# Altium schematic sheet commucation.SchDoc
size A4; SheetNumber: 2; SheetTotal: 8
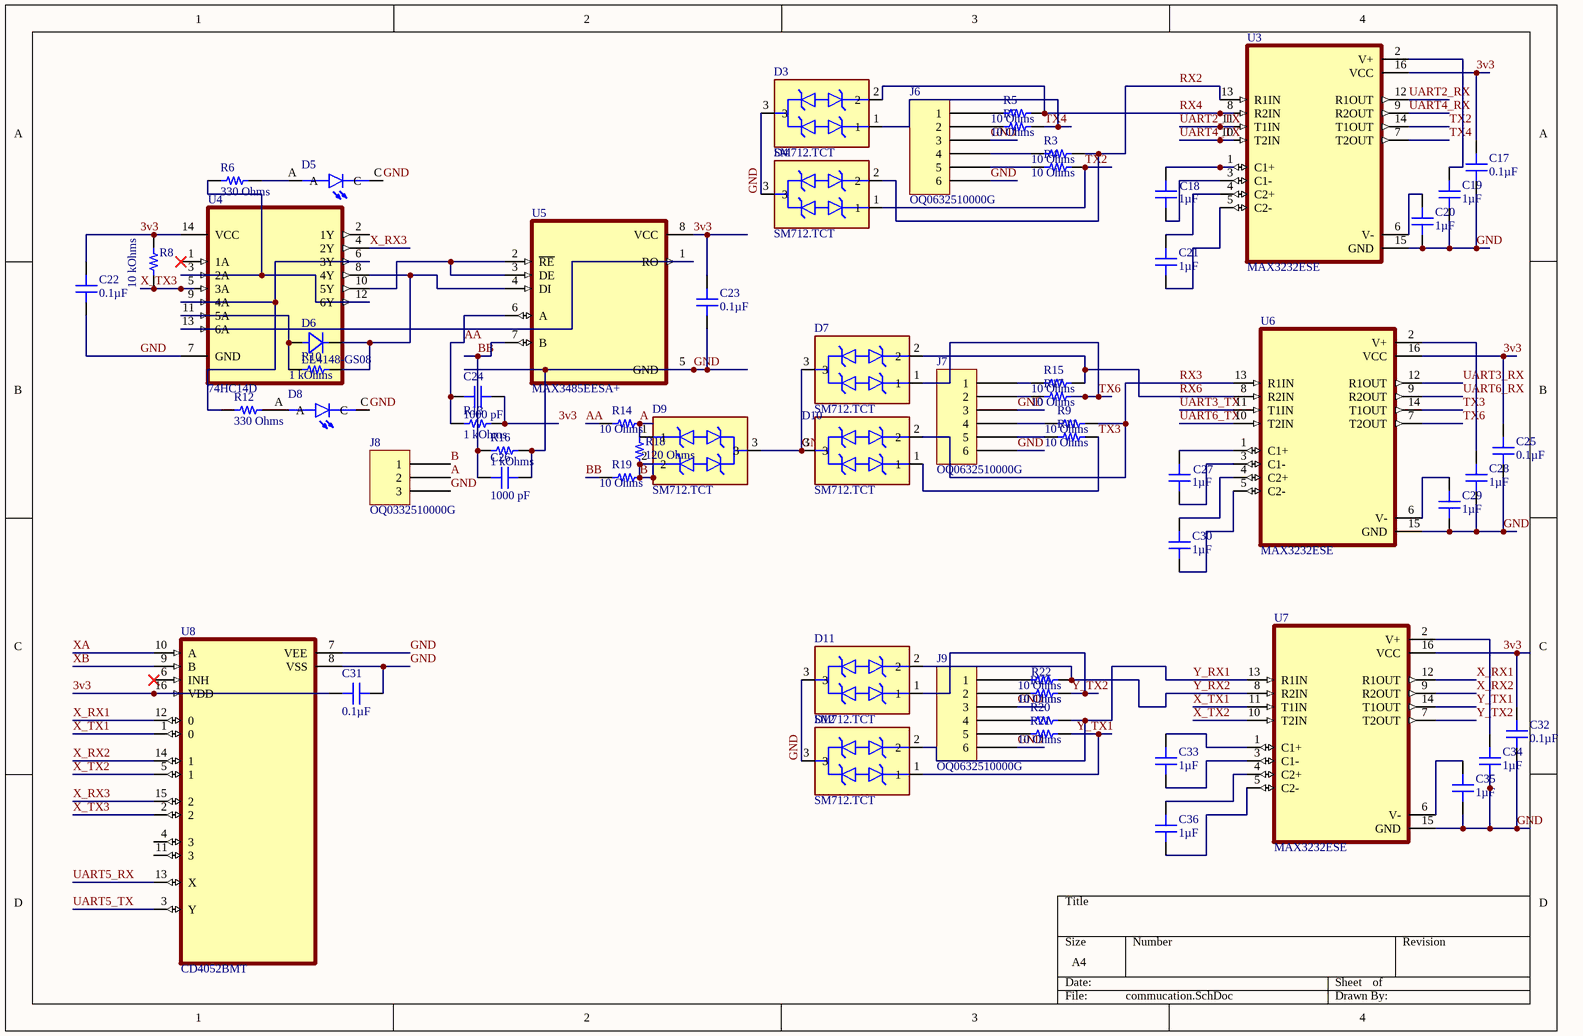
[diagram p0: commucation.SchDoc]

## Parts
C17  Capacitance: 0.1µF  [CAP 0805_2012]  (hidden comment: 1µF)
C18  1µF  [CAP 0805_2012]
C19  1µF  [CAP 0805_2012]
C20  1µF  [CAP 0805_2012]
C21  1µF  [CAP 0805_2012]
C22  Capacitance: 0.1µF  [CAP 0805_2012]  (hidden comment: 1µF)
C23  Capacitance: 0.1µF  [CAP 0805_2012]  (hidden comment: 1µF)
C24  1000 pF  [CAP 0805_2012]
C25  Capacitance: 0.1µF  [CAP 0805_2012]  (hidden comment: 1µF)
C26  1000 pF  [CAP 0805_2012]
C27  1µF  [CAP 0805_2012]
C28  1µF  [CAP 0805_2012]
C29  1µF  [CAP 0805_2012]
C30  1µF  [CAP 0805_2012]
C31  Capacitance: 0.1µF  [CAP 0805_2012]  (hidden comment: 1µF)
C32  Capacitance: 0.1µF  [CAP 0805_2012]  (hidden comment: 1µF)
C33  1µF  [CAP 0805_2012]
C34  1µF  [CAP 0805_2012]
C35  1µF  [CAP 0805_2012]
C36  1µF  [CAP 0805_2012]
D3  SM712.TCT  [SM712.TCT]
D4  SM712.TCT  [SM712.TCT]
D5  597-3305-607F  [LEDC2012X70N]  (value not drawn)
D6  LL4148-GS08  [MELF_SOD-80]
D7  SM712.TCT  [SM712.TCT]
D8  597-3305-607F  [LEDC2012X70N]  (value not drawn)
D9  SM712.TCT  [SM712.TCT]
D10  SM712.TCT  [SM712.TCT]
D11  SM712.TCT  [SM712.TCT]
D12  SM712.TCT  [SM712.TCT]
J6  OQ0632510000G  [FCI 06-381-6PIN]
J7  OQ0632510000G  [FCI 06-381-6PIN]
J8  OQ0332510000G  [FCI 06-381-3PIN]
J9  OQ0632510000G  [FCI 06-381-6PIN]
R3  10 Ohms  [RES 0805_2012]
R4  10 Ohms  [RES 0805_2012]
R5  10 Ohms  [RES 0805_2012]
R6  330 Ohms  [RES 0805_2012]
R7  10 Ohms  [RES 0805_2012]
R8  10 kOhms  [RES 0805_2012]
R9  10 Ohms  [RES 0805_2012]
R10  1 kOhms  [RES 0805_2012]
R11  10 Ohms  [RES 0805_2012]
R12  330 Ohms  [RES 0805_2012]
R13  1 kOhms  [RES 0805_2012]
R14  10 Ohms  [RES 0805_2012]
R15  10 Ohms  [RES 0805_2012]
R16  1 kOhms  [RES 0805_2012]
R17  10 Ohms  [RES 0805_2012]
R18  120 Ohms  [RES 0805_2012]
R19  10 Ohms  [RES 0805_2012]
R20  10 Ohms  [RES 0805_2012]
R21  10 Ohms  [RES 0805_2012]
R22  10 Ohms  [RES 0805_2012]
R23  10 Ohms  [RES 0805_2012]
U3  MAX3232ESE  [SOIC127P600X175-16N]
U4  74HC14D  [SOIC127P600X175-14N]
U5  MAX3485EESA+  [SOIC127P600X175-8N]
U6  MAX3232ESE  [SOIC127P600X175-16N]
U7  MAX3232ESE  [SOIC127P600X175-16N]
U8  CD4052BMT  [SOIC127P600X175-16N]

## Nets
3v3: C17.2 C22.2 C23.2 C24.2 C25.2 C31.1 C32.2 R8.2 R13.2 U3.16(VCC) U4.14(VCC) U5.8(VCC) U6.16(VCC) U7.16(VCC) U8.16(VDD)
A: D9.1 J8.2 R14.2 R18.2
AA: C24.1 R13.1 R14.1 U5.6(A)
B: D9.2 J8.1 R18.1 R19.2
BB: C26.1 R16.1 R19.1 U5.7(B)
GND: C17.1 C19.1 C20.1 C22.1 C23.1 C25.1 C26.2 C28.1 C29.1 C31.2 C32.1 C34.1 C35.1 D3.3 D4.3 D5.C D7.3 D8.C D9.3 D10.3 D11.3 D12.3 J6.3 J6.6 J7.3 J7.6 J8.3 J9.3 J9.6 R16.2 U3.15(GND) U4.7(GND) U5.5(GND) U6.15(GND) U7.15(GND) U8.7(VEE) U8.8(VSS)
RX2: D4.2 R3.2 U3.13(R1IN)
RX3: D10.2 R9.2 U6.13(R1IN)
RX4: D3.2 R5.2 U3.8(R2IN)
RX6: D7.2 R15.2 U6.8(R2IN)
TX2: D4.1 R4.2 U3.14(T1OUT)
TX3: D10.1 R11.2 U6.14(T1OUT)
TX4: D3.1 R7.2 U3.7(T2OUT)
TX6: D7.1 R17.2 U6.7(T2OUT)
UART2_RX: U3.12(R1OUT)
UART2_TX: U3.11(T1IN)
UART3_RX: U6.12(R1OUT)
UART3_TX: U6.11(T1IN)
UART4_RX: U3.9(R2OUT)
UART4_TX: U3.10(T2IN)
UART5_RX: U8.13(X)
UART5_TX: U8.3(Y)
UART6_RX: U6.9(R2OUT)
UART6_TX: U6.10(T2IN)
X_RX1: U7.12(R1OUT) U8.12(0)
X_RX2: U7.9(R2OUT) U8.14(1)
X_RX3: U4.4(2Y) U8.15(2)
X_TX1: U7.11(T1IN) U8.1(0)
X_TX2: U7.10(T2IN) U8.5(1)
X_TX3: R8.1 U4.5(3A) U8.2
XA: U8.10(A)
XB: U8.9(B)
Y_RX1: D12.2 R20.2 U7.13(R1IN)
Y_RX2: D11.2 R22.2 U7.8(R2IN)
Y_TX1: D12.1 R21.2 U7.14(T1OUT)
Y_TX2: D11.1 R23.2 U7.7(T2OUT)
NetC18_1: C18.1 U3.3(C1-)
NetC18_2: C18.2 U3.1(C1+)
NetC19_2: C19.2 U3.2(V+)
NetC20_2: C20.2 U3.6(V-)
NetC21_1: C21.1 U3.5(C2-)
NetC21_2: C21.2 U3.4(C2+)
NetC27_1: C27.1 U6.3(C1-)
NetC27_2: C27.2 U6.1(C1+)
NetC28_2: C28.2 U6.2(V+)
NetC29_2: C29.2 U6.6(V-)
NetC30_1: C30.1 U6.5(C2-)
NetC30_2: C30.2 U6.4(C2+)
NetC33_1: C33.1 U7.3(C1-)
NetC33_2: C33.2 U7.1(C1+)
NetC34_2: C34.2 U7.2(V+)
NetC35_2: C35.2 U7.6(V-)
NetC36_1: C36.1 U7.5(C2-)
NetC36_2: C36.2 U7.4(C2+)
NetD5_A: D5.A R6.2
NetD6_1: D6.1 R10.1 U4.11(5A)
NetD6_2: D6.2 R10.2 U4.8(4Y) U5.4(DI)
NetD8_A: D8.A R12.2
NetJ6_1: J6.1 R5.1
NetJ6_2: J6.2 R7.1
NetJ6_4: J6.4 R3.1
NetJ6_5: J6.5 R4.1
NetJ7_1: J7.1 R15.1
NetJ7_2: J7.2 R17.1
NetJ7_4: J7.4 R9.1
NetJ7_5: J7.5 R11.1
NetJ9_1: J9.1 R22.1
NetJ9_2: J9.2 R23.1
NetJ9_4: J9.4 R20.1
NetJ9_5: J9.5 R21.1
NetR6_1: R6.1 U4.3(2A) U4.12(6Y)
NetR12_1: R12.1 U4.6(3Y) U4.9(4A)
NetU4_10: U4.10(5Y) U5.2(~{RE}) U5.3(DE)
NetU4_13: U4.13(6A) U5.1(RO)

Not connected (* = marked no-connect by the designer): U4 1(1A)* 2(1Y); U8 4(3) 6(INH)* 11(3)

## Library data of the parts
C17-C23 C25 C27-C36 = 0805ZC105KAT4A: CAP CER 1UF 10V X7R 0805; manufacturer: AVX Corporation; Tolerance: ±10%; Part Number: 0805ZC105KAT4A; Applications: General Purpose; componentlink1description: Datasheet; componentlink1url: http://datasheets.avx.com/X7RDielectric.pdf; componentlink2description: DigiKey Link; componentlink2url: http://digikey.com/product-detail/en/avx-corporation/0805ZC105KAT4A/478-7604-1-ND/7536237; Device Package: 0805 (2012 Metric); lastupdated: 02-09-2020 1.04.40 AM; Lifecycle Status: Active; Minimum Order: 1; Mounting Type: Surface Mount, MLCC; Operating Temperature: -55°C ~ 125°C; Package / Case: 0805 (2012 Metric); packaging: TapeAndReel; partid: 3500; Part Status: Active; price: 0.17; series: -; Size / Dimension: 0.079" L x 0.049" W (2.00mm x 1.25mm); Supplier 1: DigiKey; Supplier Part Number 1: 478-7604-1-ND; Temperature Coefficient: X7R; Thickness (Max): 0.037" (0.94mm); value: 1µF; Voltage - Rated: 10V
  C18-C21 C27-C30 C33-C36: Capacitance: 1µF
C24 C26 = C0805C102F3HACAUTO: CAP CER 0805 1NF 25V ULTRA STABL; manufacturer: KEMET; Temperature Coefficient: X8R; Tolerance: ±1%; Part Number: C0805C102F3HACAUTO; Capacitance: 1000 pF; Applications: Automotive; componentlink1description: Datasheet; componentlink1url: https://api.kemet.com/component-edge/download/datasheet/C0805C102F3HACAUTO.pdf; componentlink2description: DigiKey Link; componentlink2url: https://www.digikey.com/en/products/detail/kemet/C0805C102F3HACAUTO/7958218; Device Package: 0805 (2012 Metric); Features: Low ESL, High Temperature; lastupdated: 09-02-2024 8.15.10 PM; Lifecycle Status: Active; Minimum Order: 1; Mounting Type: Surface Mount, MLCC; Operating Temperature: -55°C ~ 150°C; Package / Case: 0805 (2012 Metric); packaging: TapeAndReel; partid: 32894; Part Status: Active; price: 0.04; Ratings: AEC-Q200; series: SMD Auto X8R HT150C; Size / Dimension: 0.079" L x 0.049" W (2.00mm x 1.25mm); Supplier 1: DigiKey; Supplier Part Number 1: 399-C0805C102F3HACAUTOCT-ND; Thickness (Max): 0.035" (0.88mm); value: 1000 pF; Voltage - Rated: 25V
D3 D4 D7 D9-D12 = SM712.TCT: SM Series 12 V 400 W Asymmetrical TVS Diode for Extended Common-Mode - SOT-23; MF: Semtech Corporation; SnapEDA_Link: https://www.snapeda.com/parts/SM712.TCT/Semtech/view-part/?ref=snap; Package: SOT-23 Semtech; Value: *; MP: SM712.TCT; Check_prices: https://www.snapeda.com/parts/SM712.TCT/Semtech/view-part/?ref=eda
D5 D8 = 597-3305-607F: LED Uni-Color Green 4-Pin Chip 0805 T/R; Availability: Unavailable; Value: *; Price: None; MP: 597-3305-607F; Package: None
D6 = LL4148-GS08: Diode Standard 75 V 300mA (DC) Surface Mount SOD-80 MiniMELF; MF: Vishay General Semiconductor - Diodes Division; SnapEDA_Link: https://www.snapeda.com/parts/LL4148-GS08/Vishay+General+Semiconductor+-+Diodes+Division/view-part/?ref=snap; Package: SOD-80 Vishay Semiconductor Diodes Division; Value: *; MP: LL4148-GS08; Check_prices: https://www.snapeda.com/parts/LL4148-GS08/Vishay+General+Semiconductor+-+Diodes+Division/view-part/?ref=eda
J6 J7 J9 = OQ0632510000G: TERM BLOCK HDR 6POS 90DEG 3.81MM; Manufacturer: Amphenol Anytek; Current - UL: 10A; Header Orientation: 90°, Right Angle; Number of Levels: 1; Number of Positions: 6; Pitch: 0.150" (3.81mm); Voltage - UL: 300V; Part Number: OQ0632510000G; Color: Green; ComponentLink1Description: Datasheet; ComponentLink1URL: http://portal.fciconnect.com/Comergent//fci/drawing/oqxx32x100j0g.pdf; ComponentLink2Description: DigiKey Link; ComponentLink2URL: //digikey.com/product-detail/en/amphenol-anytek/OQ0632510000G/609-3823-ND/2261282; Contact Mating Finish: Tin; LastUpdated: 16-12-2019 7.16.11 PM; Lifecycle Status: 0; Minimum Order: 1; Mounting Type: Through Hole; Operating Temperature: -40°C ~ 115°C; Packaging: Bulk; Part Status: Active; Positions Per Level: 6; Price: 0.80; Series: 06-381; Supplier 1: DigiKey; Supplier Part Number 1: 609-3823-ND; Termination Style: Solder; Type: Header, Male Pins, Shrouded (4 Side)
J8 = OQ0332510000G: TERM BLOCK HDR 3POS 90DEG 3.81MM; Manufacturer: Amphenol Anytek; Current - UL: 10A; Header Orientation: 90°, Right Angle; Number of Levels: 1; Number of Positions: 3; Pitch: 0.150" (3.81mm); Voltage - UL: 300V; Part Number: OQ0332510000G; Color: Green; ComponentLink1Description: Datasheet; ComponentLink1URL: http://portal.fciconnect.com/Comergent//fci/drawing/oqxx32x100j0g.pdf; ComponentLink2Description: DigiKey Link; ComponentLink2URL: //digikey.com/product-detail/en/amphenol-anytek/OQ0332510000G/609-3820-ND/2261261; Contact Mating Finish: Tin; LastUpdated: 16-12-2019 7.14.46 PM; Lifecycle Status: 0; Minimum Order: 1; Mounting Type: Through Hole; Operating Temperature: -40°C ~ 115°C; Packaging: Bulk; Part Status: Active; Positions Per Level: 3; Price: 0.53; Series: 06-381; Supplier 1: DigiKey; Supplier Part Number 1: 609-3820-ND; Termination Style: Solder; Type: Header, Male Pins, Shrouded (4 Side)
R3-R5 R7 R9 R11 R14 R15 R17 R19-R23 = RNCS0805BKE10R0: RES 10 OHM 0.1% 1/10W 0805; Manufacturer: Stackpole Electronics Inc; Power (Watts): 0.1W, 1/10W; Temperature Coefficient: ±25ppm/°C; Part Number: RNCS0805BKE10R0; Value: 10 Ohms; ComponentLink1Description: Datasheet; ComponentLink1URL: https://www.seielect.com/catalog/sei-rncs_rnch.pdf; ComponentLink2Description: DigiKey Link; ComponentLink2URL: https://www.digikey.com/en/products/detail/stackpole-electronics-inc/RNCS0805BKE10R0/1800064; Composition: Thin Film; Device Package: 0805 (2012 Metric); Features: Anti-Corrosive, Automotive AEC-Q200, Moisture Resistant; Height - Seated (Max): 0.026" (0.65mm); LastUpdated: 08-02-2024 9.02.39 PM; Lifecycle Status: Active; Minimum Order: 1; Number of Terminations: 2; Operating Temperature: -55°C ~ 155°C; Package / Case: 0805 (2012 Metric); Packaging: TapeAndReel; PartId: 27711; Part Status: Active; Price: 0.07; Ratings: AEC-Q200; Resistance: 10 Ohms; Series: RNCS; Size / Dimension: 0.079" L x 0.049" W (2.00mm x 1.25mm); Supplier 1: DigiKey; Supplier Part Number 1: RNCS0805BKE10R0CT-ND; Supplier Device Package: 0805; Tolerance: ±0.1%
R6 R12 = CRCW0805330RFKEAHP: RES SMD 330 OHM 1% 1/2W 0805; Manufacturer: Vishay Dale; Power (Watts): 0.5W, 1/2W; Temperature Coefficient: ±100ppm/°C; Part Number: CRCW0805330RFKEAHP; Value: 330 Ohms; ComponentLink1Description: Datasheet; ComponentLink1URL: http://www.vishay.com/docs/20043/crcwhpe3.pdf; ComponentLink2Description: DigiKey Link; ComponentLink2URL: https://www.digikey.com/en/products/detail/vishay-dale/CRCW0805330RFKEAHP/2226912; Composition: Thick Film; Device Package: 0805 (2012 Metric); Features: Automotive AEC-Q200, Pulse Withstanding; Height - Seated (Max): 0.020" (0.50mm); LastUpdated: 08-02-2024 9.02.28 PM; Lifecycle Status: Active; Minimum Order: 1; Number of Terminations: 2; Operating Temperature: -55°C ~ 155°C; Package / Case: 0805 (2012 Metric); Packaging: TapeAndReel; PartId: 30364; Part Status: Active; Price: 0.02; Ratings: AEC-Q200; Resistance: 330 Ohms; Series: CRCW-HP; Size / Dimension: 0.079" L x 0.049" W (2.00mm x 1.25mm); Supplier 1: DigiKey; Supplier Part Number 1: 541-330TCT-ND; Supplier Device Package: 0805; Tolerance: ±1%
R8 = CPF0805B10KE: RES SMD 10K OHM 0.1% 1/10W 0805; Manufacturer: TE Connectivity Passive Product; Power (Watts): 0.1W, 1/10W; Temperature Coefficient: ±25ppm/°C; Part Number: CPF0805B10KE; Value: 10 kOhms; ComponentLink1Description: Datasheet; ComponentLink1URL: https://www.te.com/commerce/DocumentDelivery/DDEController?Action=srchrtrv&DocNm=1773200&DocType=DS&DocLang=English; ComponentLink2Description: DigiKey Link; ComponentLink2URL: https://www.digikey.com/en/products/detail/te-connectivity-passive-product/CPF0805B10KE/2389790; Composition: Thin Film; Device Package: 0805 (2012 Metric); Height - Seated (Max): 0.026" (0.65mm); LastUpdated: 08-02-2024 9.02.39 PM; Lifecycle Status: Active; Minimum Order: 1; Number of Terminations: 2; Operating Temperature: -55°C ~ 155°C; Package / Case: 0805 (2012 Metric); Packaging: TapeAndReel; PartId: 27724; Part Status: Active; Price: 0.09; Resistance: 10 kOhms; Series: CPF, Neohm; Size / Dimension: 0.079" L x 0.049" W (2.00mm x 1.25mm); Supplier 1: DigiKey; Supplier Part Number 1: A106043CT-ND; Supplier Device Package: 0805; Tolerance: ±0.1%
R10 R13 R16 = CPF0805B1K0E: RES SMD 1K OHM 0.1% 1/10W 0805; Manufacturer: TE Connectivity Passive Product; Power (Watts): 0.1W, 1/10W; Temperature Coefficient: ±25ppm/°C; Part Number: CPF0805B1K0E; Value: 1 kOhms; ComponentLink1Description: Datasheet; ComponentLink1URL: https://www.te.com/commerce/DocumentDelivery/DDEController?Action=srchrtrv&DocNm=1773200&DocType=DS&DocLang=English; ComponentLink2Description: DigiKey Link; ComponentLink2URL: https://www.digikey.com/en/products/detail/te-connectivity-passive-product/CPF0805B1K0E/2390399; Composition: Thin Film; Device Package: 0805 (2012 Metric); Height - Seated (Max): 0.026" (0.65mm); LastUpdated: 08-02-2024 9.02.39 PM; Lifecycle Status: Active; Minimum Order: 1; Number of Terminations: 2; Operating Temperature: -55°C ~ 155°C; Package / Case: 0805 (2012 Metric); Packaging: TapeAndReel; PartId: 27725; Part Status: Active; Price: 0.09; Resistance: 1 kOhms; Series: CPF, Neohm; Size / Dimension: 0.079" L x 0.049" W (2.00mm x 1.25mm); Supplier 1: DigiKey; Supplier Part Number 1: A106044CT-ND; Supplier Device Package: 0805; Tolerance: ±0.1%
R18 = RMCF0805FT120R: RES 120 OHM 1% 1/8W 0805; Manufacturer: Stackpole Electronics Inc; Power (Watts): 0.125W, 1/8W; Temperature Coefficient: ±100ppm/°C; Part Number: RMCF0805FT120R; Value: 120 Ohms; ComponentLink1Description: Datasheet; ComponentLink1URL: https://www.seielect.com/catalog/sei-rmcf_rmcp.pdf; ComponentLink2Description: DigiKey Link; ComponentLink2URL: https://www.digikey.com/en/products/detail/stackpole-electronics-inc/RMCF0805FT120R/1712658; Composition: Thick Film; Device Package: 0805 (2012 Metric); Features: Automotive AEC-Q200; Height - Seated (Max): 0.026" (0.65mm); LastUpdated: 08-02-2024 9.02.18 PM; Lifecycle Status: Active; Minimum Order: 1; Number of Terminations: 2; Operating Temperature: -55°C ~ 155°C; Package / Case: 0805 (2012 Metric); Packaging: CutTape; PartId: 32530; Part Status: Active; Price: 0.01; Ratings: AEC-Q200; Resistance: 120 Ohms; Series: RMCF; Size / Dimension: 0.079" L x 0.049" W (2.00mm x 1.25mm); Supplier 1: DigiKey; Supplier Part Number 1: 738-RMCF0805FT120RCT-ND; Supplier Device Package: 0805; Tolerance: ±1%
U3 U6 U7 = MAX3232ESE: Dual Transmitter/Receiver RS-232 16-Pin SOIC N T/R; MF: Analog Devices; MP: MAX3232ESE+T; SnapEDA_Link: https://www.snapeda.com/parts/MAX3232ESE+T/Analog+Devices/view-part/?ref=snap; Package: SOIC-16 Maxim Integrated; Value: *; Check_prices: https://www.snapeda.com/parts/MAX3232ESE+T/Analog+Devices/view-part/?ref=eda
U4 = 74HC14D: Inverter IC 6 Channel Schmitt Trigger 14-SOIC; MF: Toshiba; SnapEDA_Link: https://www.snapeda.com/parts/74HC14D/Toshiba/view-part/?ref=snap; Package: SO14-14 Nexperia USA Inc.; Value: *; MP: 74HC14D; Check_prices: https://www.snapeda.com/parts/74HC14D/Toshiba/view-part/?ref=eda
U5 = MAX3485EESA+: 3.3V Powered, Â±15kV ESD-Protected, 12Mbps, Slew-Rate-Limited True RS-485/RS-422 Transceivers; MF: Analog Devices; SnapEDA_Link: https://www.snapeda.com/parts/MAX3485EESA+/Analog+Devices/view-part/?ref=snap; Package: SOIC-8 Maxim; Value: *; MP: MAX3485EESA+; Check_prices: https://www.snapeda.com/parts/MAX3485EESA+/Analog+Devices/view-part/?ref=eda
U8 = CD4052BMT: 20-V, 4:1, 2-channel general-purpose multiplexer; MF: Texas Instruments; SnapEDA_Link: https://www.snapeda.com/parts/CD4052BMT/Texas+Instruments/view-part/?ref=snap; Package: SOIC-16 Texas Instruments; Value: *; MP: CD4052BMT; Check_prices: https://www.snapeda.com/parts/CD4052BMT/Texas+Instruments/view-part/?ref=eda